# Altium schematic sheet SolderingStation_Processor.SchDoc
size A4
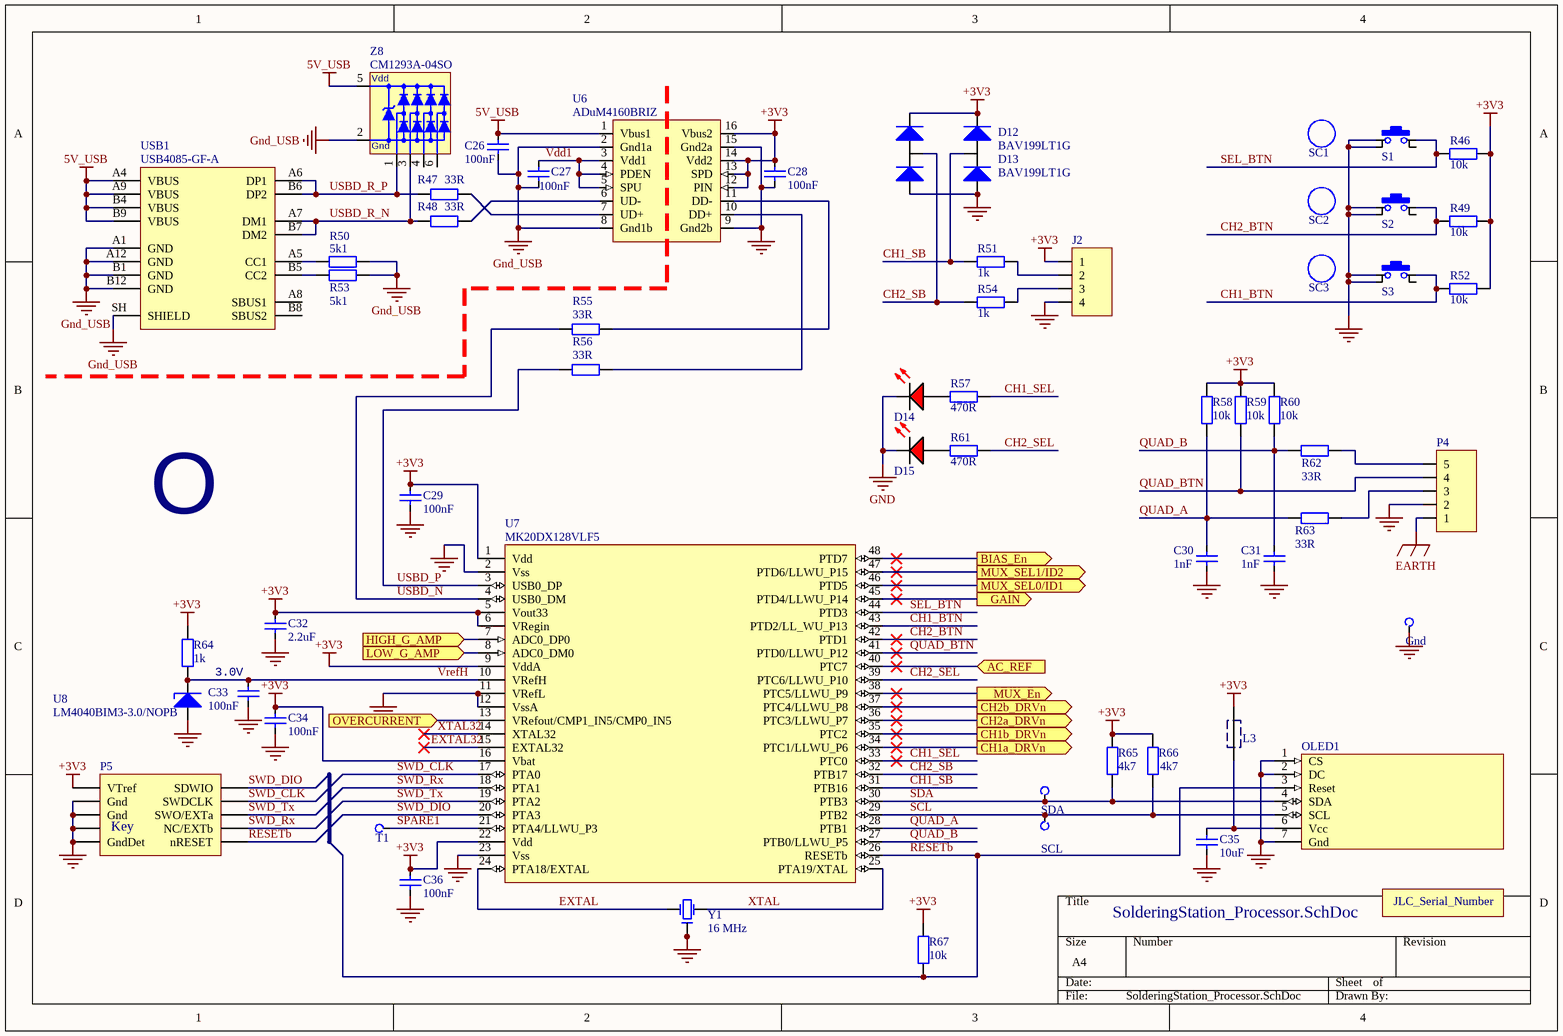
[diagram p0: SolderingStation_Processor.SchDoc]

## Parts
C26  100nF  [CCNP1608-0603]
C27  100nF  [CCNP1608-0603]
C28  100nF  [CCNP1608-0603]
C29  100nF  [CCNP1608-0603]
C30  1nF  [CCNP1608-0603]
C31  1nF  [CCNP1608-0603]
C32  2.2uF  [CCNP1608-0603]
C33  100nF  [CCNP1608-0603]
C34  100nF  [CCNP1608-0603]
C35  10uF  [CCNP2012-0805]
C36  100nF  [CCNP1608-0603]
D12  BAV199LT1G  [SOT23_M]
D13  BAV199LT1G  [SOT23_M]
D14  LED  [LED3MM-RED - 10mm Proud]  (value not drawn)
D15  LED  [LED3MM-RED - 10mm Proud]  (value not drawn)
Gnd  Gnd  [PCBPIN - 0.7mm]  (value not drawn)  (no BOM)
J2  JST XH Connector, 4-Pin  [jst-b4b-xh-ax]  (value not drawn)
JLC_Serial_Number1  JLC_Serial_Number  [JLC_Serial_Number]  (value not drawn)  (no BOM)
L3  Ferrite Bead  [FB2012-0805]  (value not drawn)
Logo1  OSHW Logo  [OSHW]  (value not drawn)  (no BOM)
OLED1  OLED_Display  [OLED_Display_128x64_2.4inch - no mounting holes]  (value not drawn)
P4  Header, 5-Pin  [HDR1X5S]  (value not drawn)
P5  SWD Connector 2x5-Pin  [SWD-2x5-Jig-Header]  (value not drawn)  (no BOM)
R46  10k  [CR1608-0603_N]
R47  33R  [CR1608-0603_N]
R48  33R  [CR1608-0603_N]
R49  10k  [CR1608-0603_N]
R50  5k1  [CR1608-0603_N]
R51  1k  [CR1608-0603_N]
R52  10k  [CR1608-0603_N]
R53  5k1  [CR1608-0603_N]
R54  1k  [CR1608-0603_N]
R55  33R  [CR1608-0603_N]
R56  33R  [CR1608-0603_N]
R57  470R  [CR1608-0603_N]
R58  10k  [CR1608-0603_N]
R59  10k  [CR1608-0603_N]
R60  10k  [CR1608-0603_N]
R61  470R  [CR1608-0603_N]
R62  33R  [CR1608-0603_N]
R63  33R  [CR1608-0603_N]
R64  1k  [CR1608-0603_N]
R65  4k7  [CR1608-0603_N]
R66  4k7  [CR1608-0603_N]
R67  10k  [CR1608-0603_N]
S1  SW_PB-B3F1052  [SW_MIN_PB-B3F1052]  (value not drawn)
S2  SW_PB-B3F1052  [SW_MIN_PB-B3F1052]  (value not drawn)
S3  SW_PB-B3F1052  [SW_MIN_PB-B3F1052]  (value not drawn)
SC1  B32-2010  [SW-CAP-B32-2010]  (value not drawn)
SC2  B32-2010  [SW-CAP-B32-2010]  (value not drawn)
SC3  B32-2010  [SW-CAP-B32-2010]  (value not drawn)
SCL  SCL  [PCBPIN - 0.7mm]  (value not drawn)  (no BOM)
SDA  SDA  [PCBPIN - 0.7mm]  (value not drawn)  (no BOM)
T1  PTA4  [PCBPIN - 0.7mm]  (value not drawn)  (no BOM)
U6  ADuM4160BRIZ  [SOIC127P1030-16M]
U7  MK20DX128VLF5  [TSQFP50P900X900-48M]
U8  LM4040BIM3-3.0/NOPB  [SOT23_M]
USB1  USB4085-GF-A  [USB4085-GF-A]
Y1  16 MHz  [Crystal_SMD_3.2x2.5]
Z8  CM1293A-04SO  [SOT457_M - 180]

## Ports
AC_REF (in), BIAS_En (out), CH1a_DRVn (out), CH1b_DRVn (out), CH2a_DRVn (out), CH2b_DRVn (out), GAIN (out), HIGH_G_AMP (in), LOW_G_AMP (in), MUX_En (out), MUX_SEL0/ID1 (out), MUX_SEL1/ID2 (out), OVERCURRENT (in)

## Nets
5V_USB: C26.2 U6.1(Vbus1) USB1.A4(VBUS) USB1.A9(VBUS) USB1.B4(VBUS) USB1.B9(VBUS) Z8.5(Vp)
+3V3: C28.2 C29.2 C32.2 C34.2 C36.2 D12.2(A2) D13.2(A2) J2.1 L3.1 P5.1(VTref) R46.2 R49.2 R52.2 R58.2 R59.2 R60.2 R64.1 R65.2 R66.2 R67.2 U6.12(PIN) U6.13(SPD) U6.14(Vdd2) U6.16(Vbus2) U7.1(Vdd) U7.5(Vout33) U7.6(VRegin) U7.9(VddA) U7.16(Vbat) U7.22(Vdd)
EARTH: P4.1
GND: C28.1 C29.1 C30.1 C31.1 C32.1 C33.1 C34.1 C35.1 C36.1 D12.1(A1) D13.1(A1) D14.K D15.K Gnd.1(TP) J2.4 OLED1.1(CS) OLED1.2(DC) OLED1.7(Gnd) P4.2 P5.0(Pins) P5.3(Gnd) P5.5(Gnd) P5.9(GndDet) S1.1 S1.1b S2.1 S2.1b S3.1 S3.1b U6.9(Gnd2b) U6.15(Gnd2a) U7.2(Vss) U7.11(VRefL) U7.12(VssA) U7.23(Vss) U8.2(A) Y1.2(Gnd) Y1.4(Gnd)
Gnd_USB: C26.1 C27.1 R50.2 R53.2 U6.2(Gnd1a) U6.8(Gnd1b) USB1.A1(GND) USB1.A12(GND) USB1.B1(GND) USB1.B12(GND) USB1.SH(SHIELD) Z8.2(Vn)
AC_REF: U7.40(PTC7) ; port AC_REF
BIAS_En: U7.48(PTD7) ; port BIAS_En
CH1_BTN: R52.1 S3.2 U7.43(PTD2/LL_WU_P13)
CH1_SB: D13.3(K) R51.1 U7.31(PTB16)
CH1_SEL: R57.1 U7.33(PTC0)
CH1a_DRVn: U7.34(PTC1/LLWU_P6) ; port CH1a_DRVn
CH1b_DRVn: U7.35(PTC2) ; port CH1b_DRVn
CH2_BTN: R49.1 S2.2 U7.42(PTD1)
CH2_SB: D12.3(K) R54.1 U7.32(PTB17)
CH2_SEL: R61.2 U7.39(PTC6/LLWU_P10)
CH2a_DRVn: U7.36(PTC3/LLWU_P7) ; port CH2a_DRVn
CH2b_DRVn: U7.37(PTC4/LLWU_P8) ; port CH2b_DRVn
EXTAL: U7.24(PTA18/EXTAL) Y1.3(OSC2)
EXTAL32: U7.15(EXTAL32)
GAIN: U7.45(PTD4/LLWU_P14) ; port GAIN
HIGH_G_AMP: U7.7(ADC0_DP0) ; port HIGH_G_AMP
LOW_G_AMP: U7.8(ADC0_DM0) ; port LOW_G_AMP
MUX_En: U7.38(PTC5/LLWU_P9) ; port MUX_En
MUX_SEL0/ID1: U7.46(PTD5) ; port MUX_SEL0/ID1
MUX_SEL1/ID2: U7.47(PTD6/LLWU_P15) ; port MUX_SEL1/ID2
OVERCURRENT: U7.13(VRefout/CMP1_IN5/CMP0_IN5) ; port OVERCURRENT
QUAD_A: C30.2 R58.1 R63.2 U7.28(PTB1)
QUAD_B: C31.2 R60.1 R62.2 U7.27(PTB0/LLWU_P5)
QUAD_BTN: P4.4 R59.1 U7.41(PTD0/LLWU_P12)
RESETb: OLED1.3(Reset) P5.10(nRESET) R67.1 U7.26(RESETb)
SCL: OLED1.5(SCL) R66.1 SCL.1(TP) U7.29(PTB2)
SDA: OLED1.4(SDA) R65.1 SDA.1(TP) U7.30(PTB3)
SEL_BTN: R46.1 S1.2 U7.44(PTD3)
SPARE1: T1.1(TP) U7.21(PTA4/LLWU_P3)
SWD_CLK: P5.4(SWDCLK) U7.17(PTA0)
SWD_DIO: P5.2(SDWIO) U7.20(PTA3)
SWD_Rx: P5.8(NC/EXTb) U7.18(PTA1)
SWD_Tx: P5.6(SWO/EXTa) U7.19(PTA2)
USBD_N: R55.2 U7.4(USB0_DM)
USBD_P: R56.2 U7.3(USB0_DP)
USBD_R_N: R48.2 USB1.A7(DM1) USB1.B7(DM2) Z8.3
USBD_R_P: R47.2 USB1.A6(DP1) USB1.B6(DP2) Z8.1
Vdd1: C27.2 U6.3(Vdd1) U6.4(PDEN) U6.5(SPU)
VrefH: C33.2 R64.2 U7.10(VRefH) U8.1(K)
XTAL: U7.25(PTA19/XTAL) Y1.1(OSC1)
XTAL32: U7.14(XTAL32)
NetC35_2: C35.2 L3.2 OLED1.6(Vcc)
NetD14_A: D14.A R57.2
NetD15_A: D15.A R61.1
NetJ2_2: J2.2 R51.2
NetJ2_3: J2.3 R54.2
NetP4_3: P4.3 R63.1
NetP4_5: P4.5 R62.1
NetR47_1: R47.1 U6.7(UD+)
NetR48_1: R48.1 U6.6(UD-)
NetR50_1: R50.1 USB1.A5(CC1)
NetR53_1: R53.1 USB1.B5(CC2)
NetR55_1: R55.1 U6.11(DD-)
NetR56_1: R56.1 U6.10(DD+)

Not connected (* = marked no-connect by the designer): S1 2b; S2 2b; S3 2b; U8 3(NC); USB1 A8(SBUS1) B8(SBUS2); Z8 4 6

## Notes on the sheet
- (near C33) 3.0V
- (in symbol CM1293A-04SO) Vdd; Gnd
- (in symbol OSHW Logo) O
- (in symbol SWD2X5_JIG) Key

## Library data of the parts
C26-C31 C33 C34 C36 = Cap_CCNP_0603: Capacitor non-polar SMT 0603; Manufacturer: Generic Components; Class: Passive; Published: 08/06/2000; Publisher: Altium Hobart Technology Centre; SubClass: Capacitor; Farnell PN: *; Digikey: *
  C26-C29 C33 C34 C36: Value: 100nF; LCSC: C14663
  C30 C31: Value: 1nF; LCSC: C1588
C32 C35 = Cap: Capacitor; Manufacturer: Generic Components; Class: Passive; Published: 08/06/2000; Publisher: Altium Hobart Technology Centre; SubClass: Capacitor; Farnell PN: *; Digikey: *
  C32: Value: 2.2uF; LCSC: C23630
  C35: Value: 10uF; LCSC: C15850
D12 D13 = BAV199LT1G: Dual Series low-leakage switching diodes, 3-Pin SOT-23; Digikey: BAV199LT1GOSCT-ND; Farnell PN: 1431115; LCSC: C145516
D14 D15 = LED_3MM_RED: 3mm Red LED; Manufacturer: Generic Components; Class I: Optoelectronic; Published: 8-Jun-2000; Revision: July-2002: Re-released for DXP Platform.; Publisher: Altium Limited; Class II: LED; Digikey: *; Farnell PN: *; LCSC: *
Gnd SCL SDA T1 = TP: Test Point; Digikey: *; Farnell PN: *; LCSC: *
J2 = JST-B4B-XH-A: LatestRevisionDate: 17-Jul-2002; LatestRevisionNote: Re-released for DXP Platform.; Publisher: Altium Limited; LCSC: *; Farnell PN: 1516278; Digikey: 455-2249-ND
L3 = Ferrite Bead 0805: Ferrite Bead SMT 0805, TDK MPZ2012S102AT, 0.15OHM, 1.5A; Farnell PN: 1669733; Digikey: *; LCSC: C1017
OLED1 = OLED_Display_128x64_2.4inch: OLED Display 128x64 pixels, 2.4inch; LCSC: *
P4 = Header 1x5: LatestRevisionDate: 17-Jul-2002; LatestRevisionNote: Re-released for DXP Platform.; Publisher: Altium Limited; LCSC: *
P5 = SWD2X5_JIG: LatestRevisionDate: 17-Jul-2002; LatestRevisionNote: Re-released for DXP Platform.; Publisher: Altium Limited; Farnell PN: 1865285; LCSC: *
R46-R67 = Res_CR0603: Resistor SMT 0603; Manufacturer: Generic Components; Class: Passive; Published: 08/06/2000; Publisher: Altium Hobart Technology Centre; SubClass: Resistor; Farnell PN: *; Digikey: *
  R46 R49 R52 R58-R60 R67: Value: 10k; LCSC: C25804
  R47 R48 R55 R56 R62 R63: Value: 33R; LCSC: C23140
  R50 R53: Value: 5k1; LCSC: C23186
  R51 R54 R64: Value: 1k; LCSC: C21190
  R57 R61: Value: 470R; LCSC: C23179
  R65 R66: Value: 4k7; LCSC: C23162
S1-S3 = SW_PB-B3F1052: Switch miniature push-button; Manufacturer: Generic Components; Published: 24-Mar-1999; Revision: July-2002: Re-released for DXP Platform.; Publisher: Altium Limited; Farnell PN: 196094202; LCSC: *
SC1-SC3 = Switch-Cap - B32-2010: Switch Cap; Farnell PN: 2352313
U6 = ADuM4160BRIZ: Full/Low Speed 5 kV USB Digital Isolator; Farnell PN: 2061081
U7 = MK20DX128VLF5: Kinetis K20: 50MHz Cortex-M4 Performance MCU, 160KB Flash, 16KB SRAM, Full-Speed USB, 48-LQFP; Farnell PN: 2133571; Digikey: MK20DX128VLF50-ND; Mouser: 841-MK20DX128VLF5; LCSC: *
U8 = LM4040BIM3-2.5/NOPB: IC 2.5V VREF SHUNT 0.2% SOT23-3; Digikey: LM4040BIM3X-2.5/NOPBCT-ND; Farnell PN: 3124419; LCSC: C131939
USB1 = USB4085-GF-A: USB-C, USB 2.0 Receptacle Connector 16 Position Through Hole, Right Angle; Angle: 90; Part Number: USB4085-GF-A; Digikey Part Number: 2073-USB4085-GF-ACT-ND; Digikey Link: https://www.digikey.ee/product-detail/en/gct/USB4085-GF-A/2073-USB4085-GF-ACT-ND/9859733; Farnell PN: 2924867; Digikey: 2073-USB4085-GF-ACT-ND; LCSC: *
Y1 = Crystal 16MHz: Crystal SMD 3.2 x 2.5 x 0.7 mm; Manufacturer: Generic Components; Class: Oscillator; SubClass: Crystal Oscillator; Published: 08/06/2000; Publisher: Altium Hobart Technology Centre; Digikey: *; Farnell PN: *; LCSC: C13738
Z8 = CM1293A-04SO: Ultra low capacitance quadruple rail-to-rail ESD protection; Farnell PN: 2533258; Digikey: CM1293A-04SOOSCT-ND; LCSC: C393377